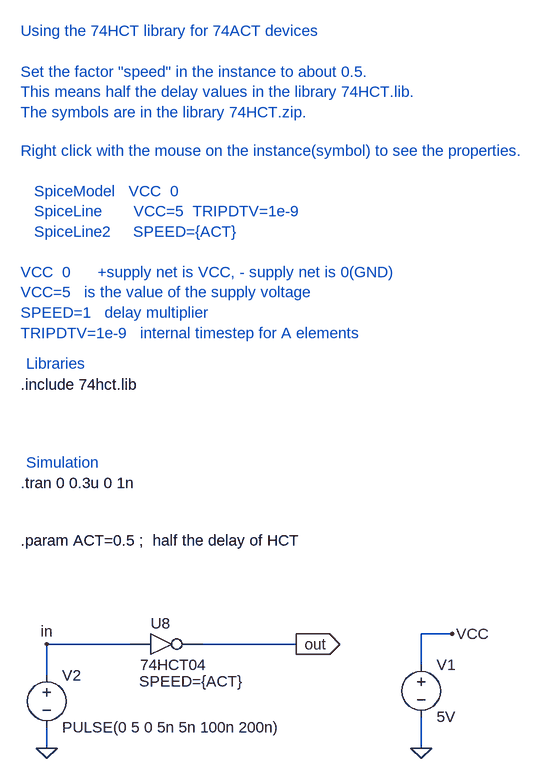
[diagram p0: schematic 74ACT_Example.asc]
74ACT_Example.asc, the LTspice schematic file:
Version 4
SHEET 1 956 1212
WIRE -176 -176 -176 -224
WIRE -176 -64 -176 -96
WIRE -48 -224 -176 -224
WIRE 208 -224 64 -224
WIRE 400 -192 400 -240
WIRE 400 -64 400 -112
WIRE 448 -240 400 -240
FLAG 400 -64 0
FLAG 448 -240 VCC
FLAG -176 -64 0
FLAG -176 -224 in
FLAG 208 -224 out
IOPIN 208 -224 Out
SYMBOL voltage 400 -208 R0
SYMATTR InstName V1
SYMATTR Value 5V
SYMBOL voltage -176 -192 R0
WINDOW 123 0 0 Left 0
WINDOW 39 0 0 Left 0
SYMATTR InstName V2
SYMATTR Value PULSE(0 5 0 5n 5n 100n 200n)
SYMBOL 74hct04 0 -288 R0
WINDOW 40 -34 121 Left 0
SYMATTR InstName U8
SYMATTR SpiceLine VCC=5  TRIPDT=1e-9
SYMATTR SpiceLine2 SPEED={ACT}
TEXT -216 -624 Left 0 !.include 74hct.lib
TEXT -216 -472 Left 0 !.tran 0 0.3u 0 1n
TEXT -208 -656 Left 0 ;Libraries
TEXT -208 -504 Left 0 ;Simulation
TEXT -216 -984 Left 0 ;Right click with the mouse on the instance(symbol) to see the properties.\n \n   SpiceModel   VCC  0                    \n   SpiceLine       VCC=5  TRIPDTV=1e-9     \n   SpiceLine2     SPEED={ACT}\n \nVCC  0      +supply net is VCC, - supply net is 0(GND)\nVCC=5   is the value of the supply voltage\nSPEED=1   delay multiplier\nTRIPDTV=1e-9   internal timestep for A elements
TEXT -216 -384 Left 0 !.param ACT=0.5 ;  half the delay of HCT
TEXT -216 -1168 Left 0 ;Using the 74HCT library for 74ACT devices\n \nSet the factor "speed" in the instance to about 0.5.\nThis means half the delay values in the library 74HCT.lib.\nThe symbols are in the library 74HCT.zip.

The netlist it stands for:
* 74ACT_Example.asc
V1 VCC 0 5V
V2 in 0 PULSE(0 5 0 5n 5n 100n 200n)
XU8 in out VCC 0 74HCT04 VCC=5  TRIPDT=1e-9 SPEED={ACT}  ; pins A Y
.include 74hct.lib
.tran 0 0.3u 0 1n
* Libraries
* Simulation
* Right click with the mouse on the instance(symbol) to see the properties.
*    SpiceModel   VCC  0
*    SpiceLine       VCC=5  TRIPDTV=1e-9
*    SpiceLine2     SPEED={ACT}
* VCC  0      +supply net is VCC, - supply net is 0(GND)
* VCC=5   is the value of the supply voltage
* SPEED=1   delay multiplier
* TRIPDTV=1e-9   internal timestep for A elements
.param ACT=0.5 ;  half the delay of HCT
* Using the 74HCT library for 74ACT devices
* Set the factor "speed" in the instance to about 0.5.
* This means half the delay values in the library 74HCT.lib.
* The symbols are in the library 74HCT.zip.
.backanno
.end